# Altium schematic sheet Digital_SRAM.SchDoc
size A
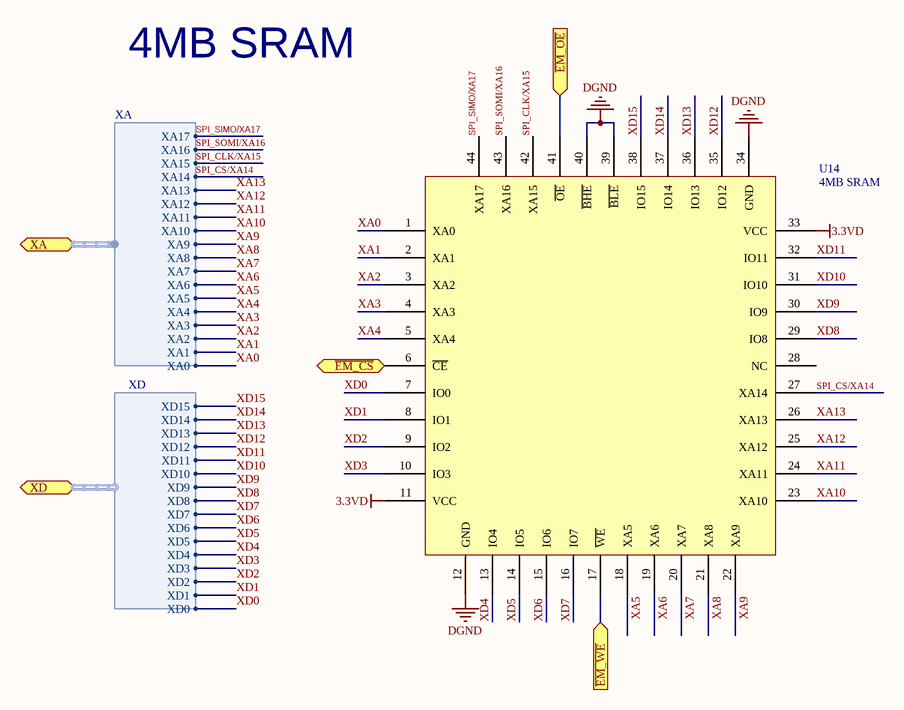
[diagram p0: Digital_SRAM.SchDoc]

## Parts
U14  4MB SRAM  [TSOP-44]

## Ports
XA (harness XA), XD (harness XD), ~{EM_CS} (in), ~{EM_OE} (in), ~{EM_WE} (in)

## Harnesses
XA: XA17, XA16, XA15, XA14, XA13, XA12, XA11, XA10, XA9, XA8, XA7, XA6, XA5, XA4, XA3, XA2, XA1, XA0
XD: XD15, XD14, XD13, XD12, XD11, XD10, XD9, XD8, XD7, XD6, XD5, XD4, XD3, XD2, XD1, XD0

## Nets
3.3VD: U14.11(VCC) U14.33(VCC)
DGND: U14.12(GND) U14.34(GND) U14.39(~{BLE}) U14.40(~{BHE})
~{EM_CS}: U14.6(~{CE}) ; port ~{EM_CS}
~{EM_OE}: U14.41(~{OE}) ; port ~{EM_OE}
~{EM_WE}: U14.17(~{WE}) ; port ~{EM_WE}
SPI_CLK/XA15: U14.42(XA15) ; port XA.XA15
SPI_CS/XA14: U14.27(XA14) ; port XA.XA14
SPI_SIMO/XA17: U14.44(XA17) ; port XA.XA17
SPI_SOMI/XA16: U14.43(XA16) ; port XA.XA16
XA0: U14.1(XA0) ; port XA.XA0
XA1: U14.2(XA1) ; port XA.XA1
XA2: U14.3(XA2) ; port XA.XA2
XA3: U14.4(XA3) ; port XA.XA3
XA4: U14.5(XA4) ; port XA.XA4
XA5: U14.18(XA5) ; port XA.XA5
XA6: U14.19(XA6) ; port XA.XA6
XA7: U14.20(XA7) ; port XA.XA7
XA8: U14.21(XA8) ; port XA.XA8
XA9: U14.22(XA9) ; port XA.XA9
XA10: U14.23(XA10) ; port XA.XA10
XA11: U14.24(XA11) ; port XA.XA11
XA12: U14.25(XA12) ; port XA.XA12
XA13: U14.26(XA13) ; port XA.XA13
XD0: U14.7(IO0) ; port XD.XD0
XD1: U14.8(IO1) ; port XD.XD1
XD2: U14.9(IO2) ; port XD.XD2
XD3: U14.10(IO3) ; port XD.XD3
XD4: U14.13(IO4) ; port XD.XD4
XD5: U14.14(IO5) ; port XD.XD5
XD6: U14.15(IO6) ; port XD.XD6
XD7: U14.16(IO7) ; port XD.XD7
XD8: U14.29(IO8) ; port XD.XD8
XD9: U14.30(IO9) ; port XD.XD9
XD10: U14.31(IO10) ; port XD.XD10
XD11: U14.32(IO11) ; port XD.XD11
XD12: U14.35(IO12) ; port XD.XD12
XD13: U14.36(IO13) ; port XD.XD13
XD14: U14.37(IO14) ; port XD.XD14
XD15: U14.38(IO15) ; port XD.XD15

Not connected (* = marked no-connect by the designer): U14 28(NC)

## Notes on the sheet
- 4MB SRAM

## Library data of the parts
U14 = CY7C1041CV33-8ZSXI: IC SRAM 4MBIT 8NS 44TSOP; Supplier 1: Digi-Key; Supplier Part Number 1: 428-3284-ND